# EasyEDA schematic SCH_Sensor Frame PCB_2022-08-15.json
TITLE: Sheet_1; REV: 1.0; Date: 2022-06-12; Sheet: 1/1; Drawn By: Edward Niedziejko; Company: Your Company
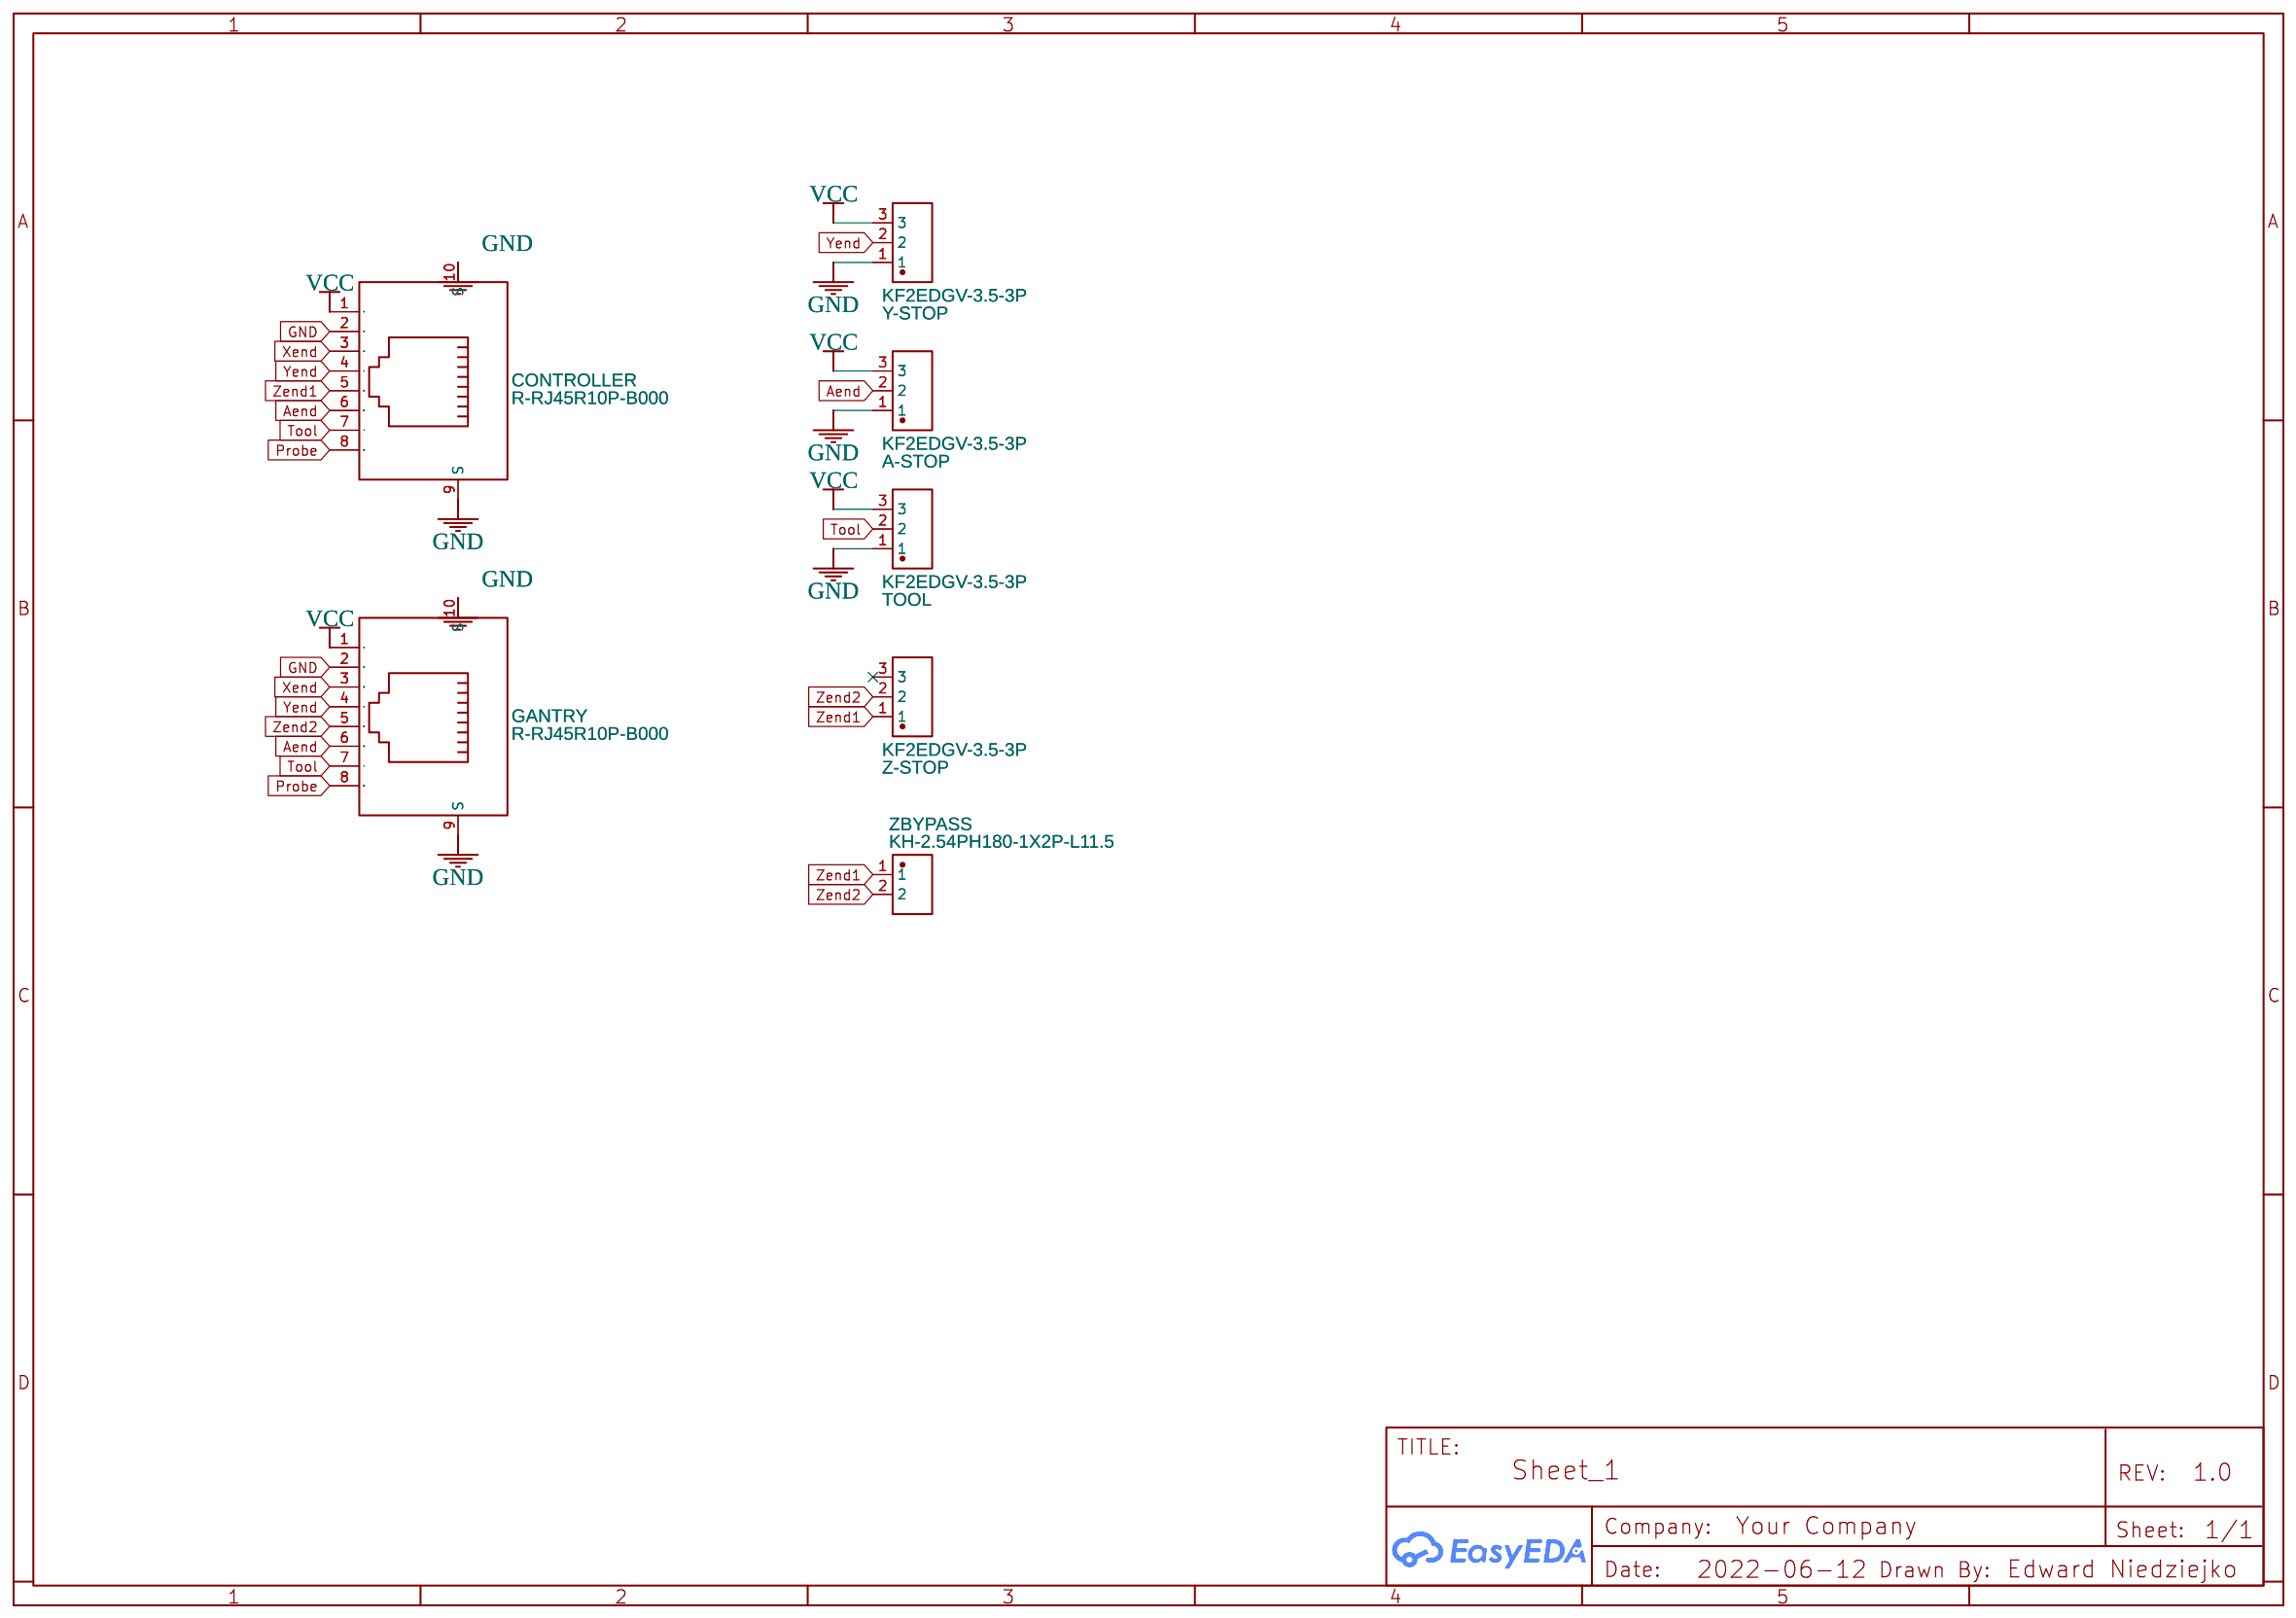
[diagram p0: schematic sheet]

## Parts
A-STOP  KF2EDGV-3.5-3P  [CONN-TH_3P-P3.50_KF2EDGV-3.5-3P]
CONTROLLER  R-RJ45R10P-B000  [RJ45-TH_R-RJ45R10P-B000]
GANTRY  R-RJ45R10P-B000  [RJ45-TH_R-RJ45R10P-B000]
TOOL  KF2EDGV-3.5-3P  [CONN-TH_3P-P3.50_KF2EDGV-3.5-3P]
Y-STOP  KF2EDGV-3.5-3P  [CONN-TH_3P-P3.50_KF2EDGV-3.5-3P]
Z-STOP  KF2EDGV-3.5-3P  [CONN-TH_3P-P3.50_KF2EDGV-3.5-3P]
ZBYPASS  KH-2.54PH180-1X2P-L11.5  [HDR-TH_2P-P2.54-V-M]

## Library data of the parts
A-STOP TOOL Y-STOP Z-STOP = KF2EDGV-3.5-3P: Supplier: LCSC; Supplier Part: C441322; Manufacturer: Cixi Kefa Elec; Contributor: LCSC; JLCPCB Part Class: Extended Part
CONTROLLER GANTRY = R-RJ45R10P-B000: Supplier: LCSC; Supplier Part: C386758; Manufacturer: Shenzhen Cankemeng; Contributor: LCSC; JLCPCB Part Class: Extended Part
ZBYPASS = KH-2.54PH180-1X2P-L11.5: Supplier: LCSC; Supplier Part: C2905434; Manufacturer: kinghelm(金航标); Contributor: LCSC; JLCPCB Part Class: Extended Part

## Nets
GND: A-STOP.1 CONTROLLER.2 CONTROLLER.9(S) CONTROLLER.10(S) GANTRY.2 GANTRY.9(S) GANTRY.10(S) TOOL.1 Y-STOP.1
VCC: A-STOP.3 CONTROLLER.1 GANTRY.1 TOOL.3 Y-STOP.3
Aend: A-STOP.2 CONTROLLER.6 GANTRY.6
Probe: CONTROLLER.8 GANTRY.8
Tool: CONTROLLER.7 GANTRY.7 TOOL.2
Xend: CONTROLLER.3 GANTRY.3
Yend: CONTROLLER.4 GANTRY.4 Y-STOP.2
Zend1: CONTROLLER.5 Z-STOP.1 ZBYPASS.1
Zend2: GANTRY.5 Z-STOP.2 ZBYPASS.2

Not connected (* = marked no-connect by the designer): Z-STOP 3*
